# EasyEDA schematic LLU_PCB V2.json
TITLE: LLU_PCB_V2; REV: 0.5; Date: 2019-02-02; Sheet: 1/1; Drawn By: Deadmau5; Company: MatyFM
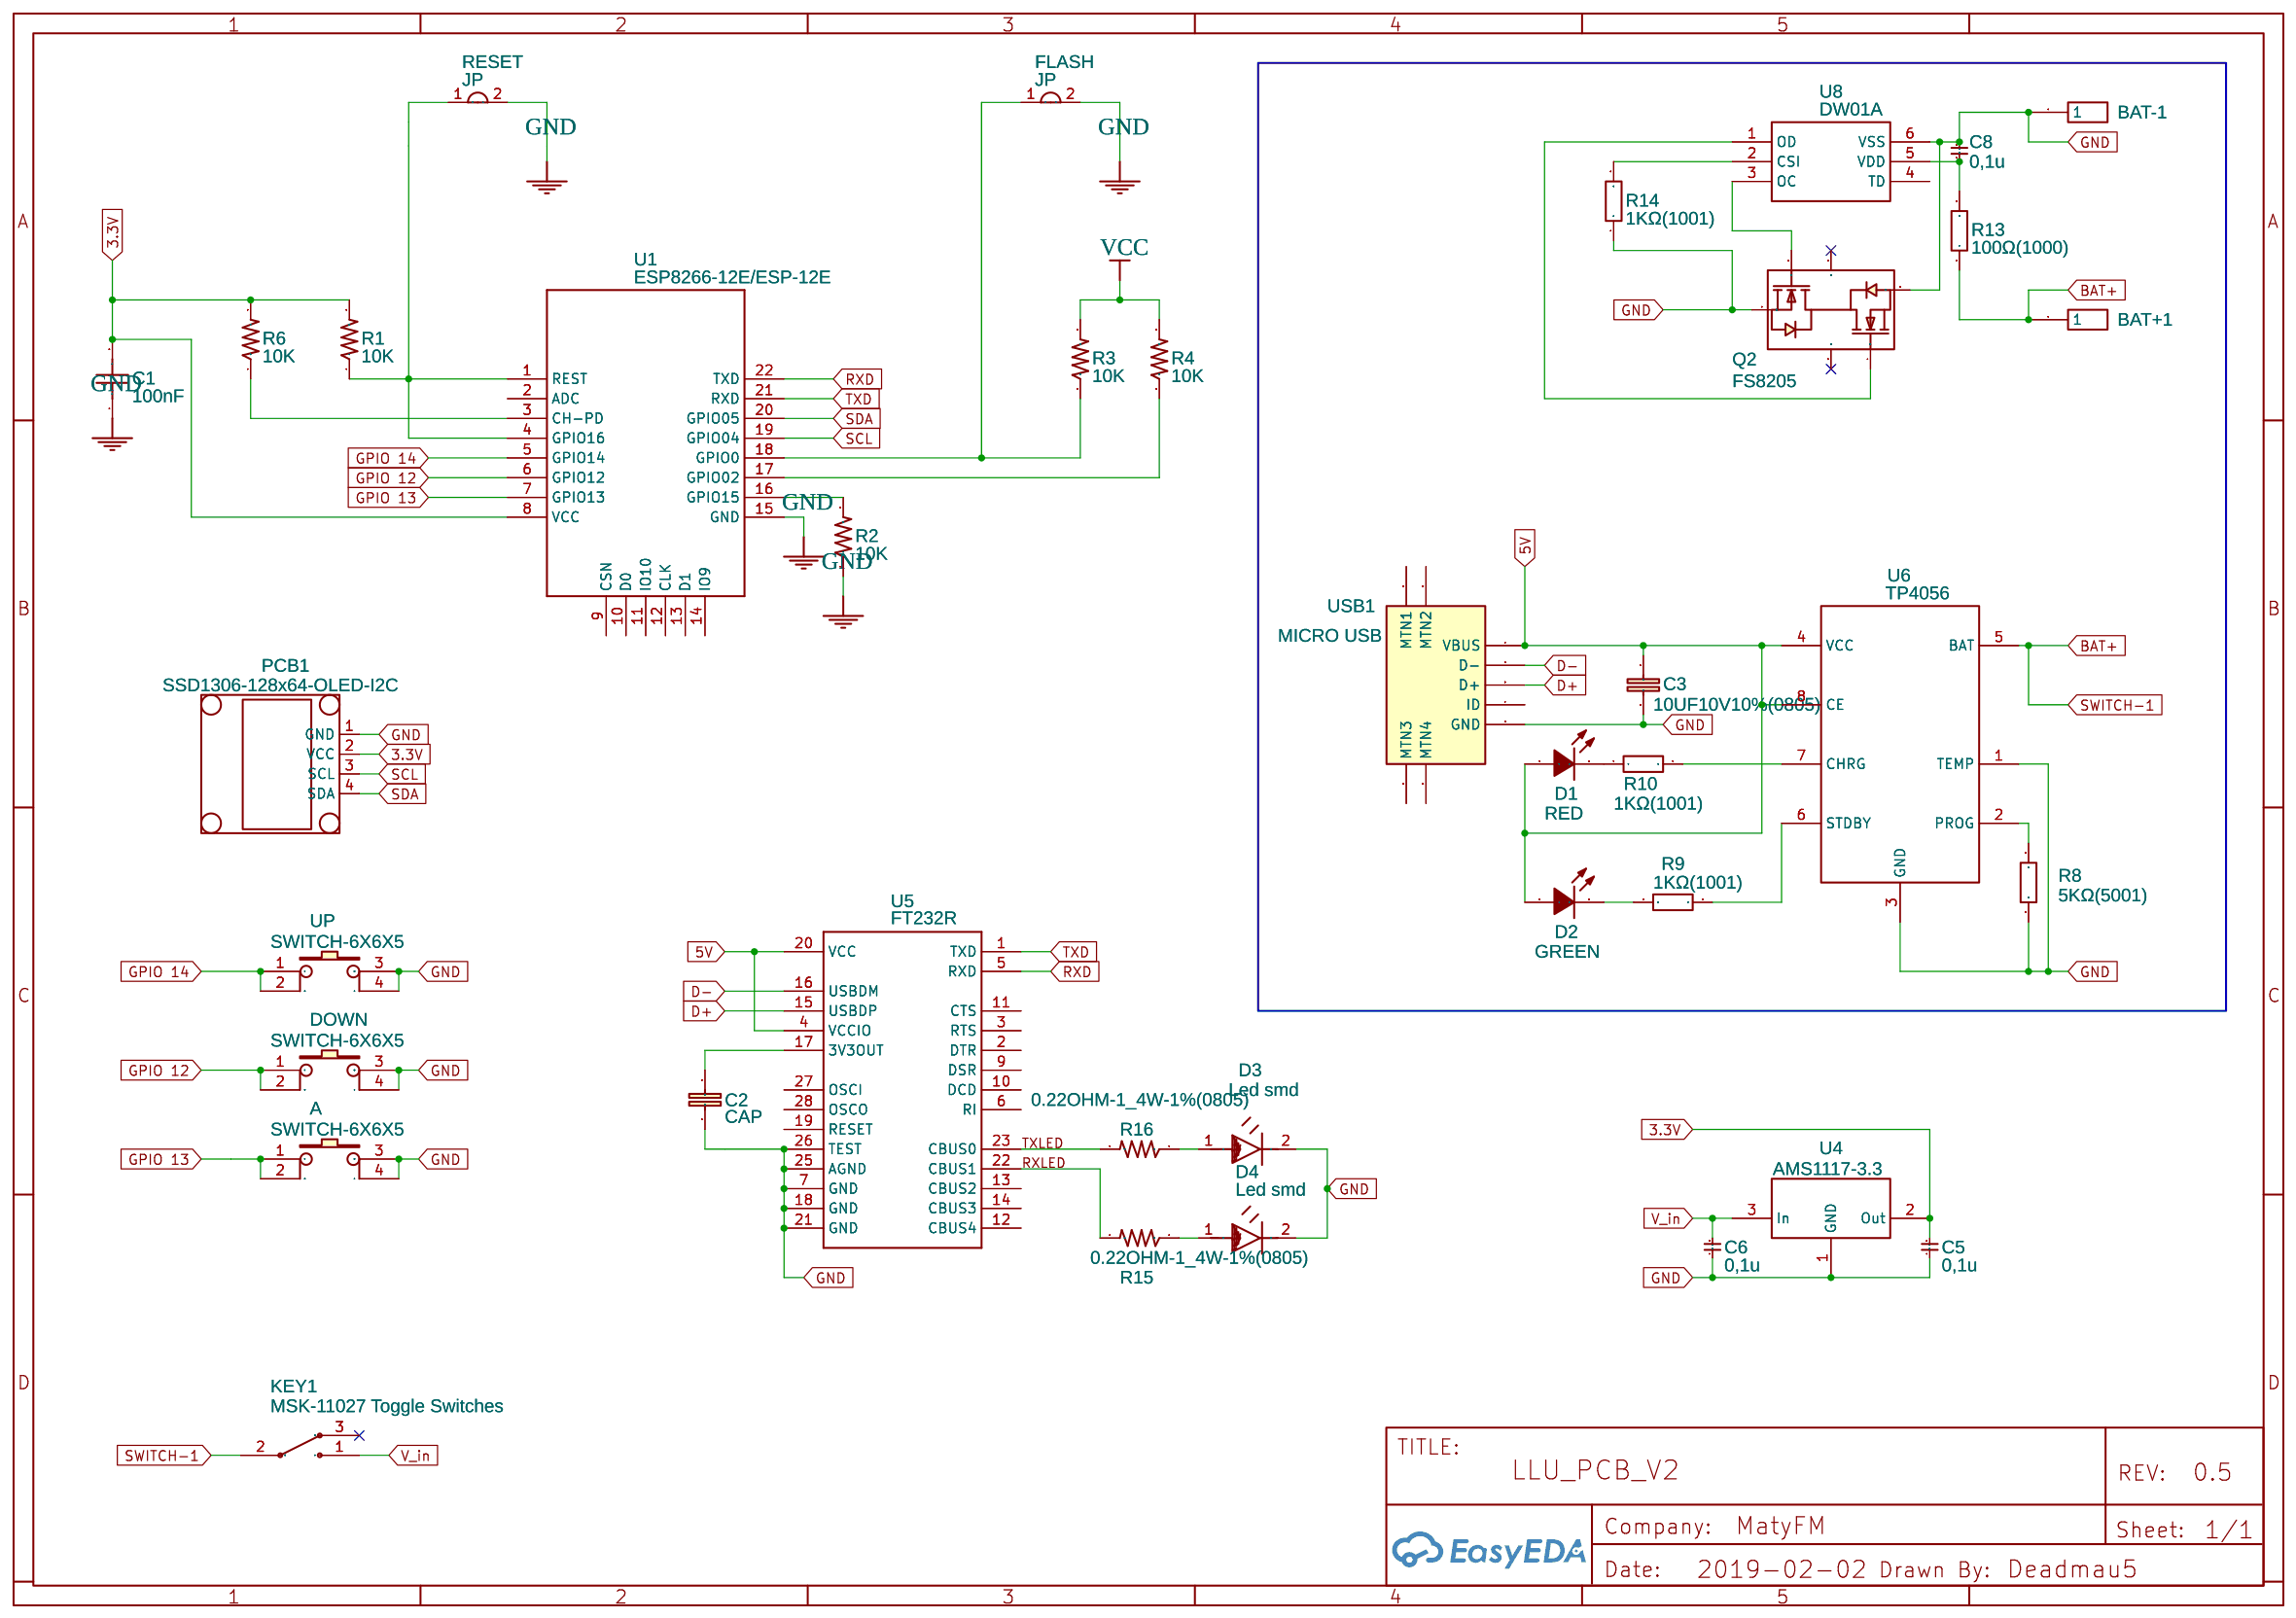
[diagram p0: schematic sheet]

## Parts
A  SWITCH-6X6X5  [SWITCH-6X6X5_TH]
BAT+1  BAT+  [HDR-1X1/2.54]
BAT-1  BAT-  [HDR-1X1/2.54]
C1  100nF  [0805]
C2  CAP  [0805]
C3  10UF10V10%(0805)  [0805-CAP]
C5  0,1u  [0805]
C6  0,1u  [0805]
C8  0,1u  [0805]
D1  RED  [LED-0603]
D2  GREEN  [LED-0603]
D3  Led smd  [LED SMD]
D4  Led smd  [LED SMD]
DOWN  SWITCH-6X6X5  [SWITCH-6X6X5_TH]
FLASH  JP  [SMD_JUMPER]
KEY1  MSK-11027 Toggle Switches  [MSK-11027]
PCB1  SSD1306-128x64-OLED-I2C  [SSD1306_ARDUINO]
Q2  FS8205  [SOT-23-6]
R1  10K  [0603-RES]
R2  10K  [0603-RES]
R3  10K  [0603-RES]
R4  10K  [0603-RES]
R6  10K  [0603-RES]
R8  5KΩ(5001)  [0805]
R9  1KΩ(1001)  [0805]
R10  1KΩ(1001)  [0805]
R13  100Ω(1000)  [0805]
R14  1KΩ(1001)  [0805]
R15  0.22OHM-1_4W-1%(0805)  [0805]
R16  0.22OHM-1_4W-1%(0805)  [0805]
RESET  JP  [SMD_JUMPER]
U1  ESP8266-12E/ESP-12E  [LGA22-2.0-24X16MM]
U4  AMS1117-3.3  [SOT-223]
U5  FT232R  [SSOP-28]
U6  TP4056  [SOP-8_EP_150MIL]
U8  DW01A  [SOT-23-6]
UP  SWITCH-6X6X5  [SWITCH-6X6X5_TH]
USB1  MICRO USB  [MICRO-USB-1]

## Library data of the parts
A DOWN UP = -: Supplier: LCSC; Manufacturer: ReliaPro; Supplier Part: C69330
BAT+1 BAT-1 = -: Supplier: LCSC; Manufacturer: ReliaPro; Manufacturer Part: Header 1*1P; Supplier Part: C81276
C1 = Capasitor_0805: Supplier Part: C97898; Supplier: LCSC; Manufacturer: MuRata; Manufacturer Part: GRM2165C1H122JA01D; Tolerance: ±5%; Rated Voltage: 50V; Contributor: re.eule
C2 = -: catid: 20; Contributor: SparkFun; Manufacturer Part: ?
C3 = -: CAP-11330; Contributor: SparkFun; Manufacturer Part: ?
C5 C6 C8 = -: Voltage: 25V; Tolerance: ±20%; Supplier: LCSC; Manufacturer: FH; Manufacturer Part: 0805F106M250NT; Supplier Part: C48181
D1 = -: Supplier: LCSC; Manufacturer: LITEON; Manufacturer Part: LTST-C191KRKT; Contributor: LCSC; Supplier Part: C125099
D2 = -: Supplier: LCSC; Manufacturer: LITEON; Manufacturer Part: LTST-C193TGKT-5A; Supplier Part: C12065
D3 D4 = -: Contributor: jalvarez
FLASH RESET = -: Manufacturer Part: SMD-Jumper; Contributor: christophnienhaus2
KEY1 = -: Supplier: LCSC; Manufacturer: ReliaPro; image: http://image.lceda.cn/szlcsc/C21381.jpg
PCB1 = -: sourceId: wICUcuL3l; Manufacturer Part: ?
Q2 = -: Supplier: LCSC; Manufacturer: FORTUNE; Supplier Part: C32254
R1-R4 R6 = -: RES-00824; catid: 20; Contributor: SparkFun; Manufacturer Part: ?
R8 = RT0805BRD075K1L: Supplier: LCSC; Manufacturer: YAGEO; Supplier Part: C122968
R9 R10 = RT0805BRD071KL: Supplier: LCSC; Manufacturer: YAGEO; Supplier Part: C110774
R13 = CR0805F81000G: Supplier: LCSC; Manufacturer: LIZ; Supplier Part: C101403
R14 = RTT051001FTP: Supplier: LCSC; Manufacturer: RALEC; Supplier Part: C103903
R15 R16 = -: RES-09883; catid: 20; Contributor: SparkFun; Manufacturer Part: ?
U1 = -: SMD ESP8266 based WiFi module FCC/CE; catid: 20; Supplier: SeeedStudio; Supplier Part: 317060015
U4 = -: sourceId: HltLFyQwq; Supplier: LCSC; Manufacturer: AMS; Manufacturer Part: AMS1117-5.0; LCSC Assembly: Yes; image: //image.lceda.cn/szlcsc/C6187.jpg; Supplier Part: C6187
U5 = -: FT232R USB UART IC; catid: 20; Contributor: SparkFun; Manufacturer Part: ?
U6 = -: Contributor: Guest; Supplier: LCSC; Manufacturer: TOPPOWER; Supplier Part: C16581
U8 = -: Supplier: LCSC; Manufacturer: FM; Supplier Part: C85680
USB1 = -: Supplier: LCSC; Manufacturer: LCSC; Manufacturer Part: MICRO USB 5S B; Supplier Part: C10418

## Nets
3.3V: C1.2 C5.2 PCB1.2(VCC) R1.2 R6.2 U1.8(VCC) U4.2(Out)
5V: C3.1 D1.1(A) D2.1(A) U5.4(VCCIO) U5.20(VCC) U6.4(VCC) U6.8(CE) USB1.1(VBUS)
GND: A.3 A.4 BAT-1.1 C1.1 C2.2 C3.2 C5.1 C6.1 C8.2 D3.2 D4.2 DOWN.3 DOWN.4 FLASH.2 PCB1.1(GND) Q2.1(S1) Q2.3(S2) R2.1 R8.1 R14.1 RESET.2 U1.15(GND) U4.1(GND) U5.7(GND) U5.18(GND) U5.21(GND) U5.25(AGND) U5.26(TEST) U6.1(TEMP) U6.3(GND) U8.6(VSS) UP.3 UP.4 USB1.5(GND)
VCC: R3.2 R4.2
BAT+: BAT+1.1 KEY1.2 R13.1 U6.5(BAT)
D+: U5.15(USBDP) USB1.3(D+)
D-: U5.16(USBDM) USB1.2(D-)
GPIO 12: DOWN.1 DOWN.2 U1.6(GPIO12)
GPIO 13: A.1 A.2 U1.7(GPIO13)
GPIO 14: U1.5(GPIO14) UP.1 UP.2
RXD: U1.22(TXD) U5.5(RXD)
SCL: PCB1.3(SCL) U1.19(GPIO04)
SDA: PCB1.4(SDA) U1.20(GPIO05)
TXD: U1.21(RXD) U5.1(TXD)
V_in: C6.2 KEY1.1 U4.3(In)
Net-(C2-1): C2.1 U5.17(3V3OUT)
Net-(C8-1): C8.1 R13.2 U8.5(VDD)
Net-(D1-2): D1.2(K) R10.1
Net-(D2-2): D2.2(K) R9.1
Net-(D3-1): D3.1 R16.1
Net-(D4-1): D4.1 R15.1
Net-(FLASH-1): FLASH.1 R3.1 U1.18(GPIO0)
Net-(Q2-4): Q2.4(G2) U8.1(OD)
Net-(Q2-6): Q2.6(G1) U8.3(OC)
Net-(R1-1): R1.1 RESET.1 U1.1(REST) U1.4(GPIO16)
Net-(R2-2): R2.2 U1.16(GPIO15)
Net-(R4-1): R4.1 U1.17(GPIO02)
Net-(R6-1): R6.1 U1.3(CH-PD)
Net-(R8-2): R8.2 U6.2(PROG)
Net-(R9-2): R9.2 U6.6(STDBY)
Net-(R10-2): R10.2 U6.7(CHRG)
Net-(R14-2): R14.2 U8.2(CSI)
Net-(R15-2): R15.2 U5.22(CBUS1)
Net-(R16-2): R16.2 U5.23(CBUS0)

Not connected (* = marked no-connect by the designer): KEY1 3*; Q2 2(D12)* 5(D12)*; U1 2(ADC) 9(CSN) 10(D0) 11(IO10) 12(CLK) 13(D1) 14(IO9); U5 2(DTR) 3(RTS) 6(RI) 9(DSR) 10(DCD) 11(CTS) 12(CBUS4) 13(CBUS2) 14(CBUS3) 19(RESET) 27(OSCI) 28(OSCO); U8 4(TD); USB1 0(MTN1) 4(ID)
